# Altium schematic sheet 17.SchDoc
size 513 x 386 mm
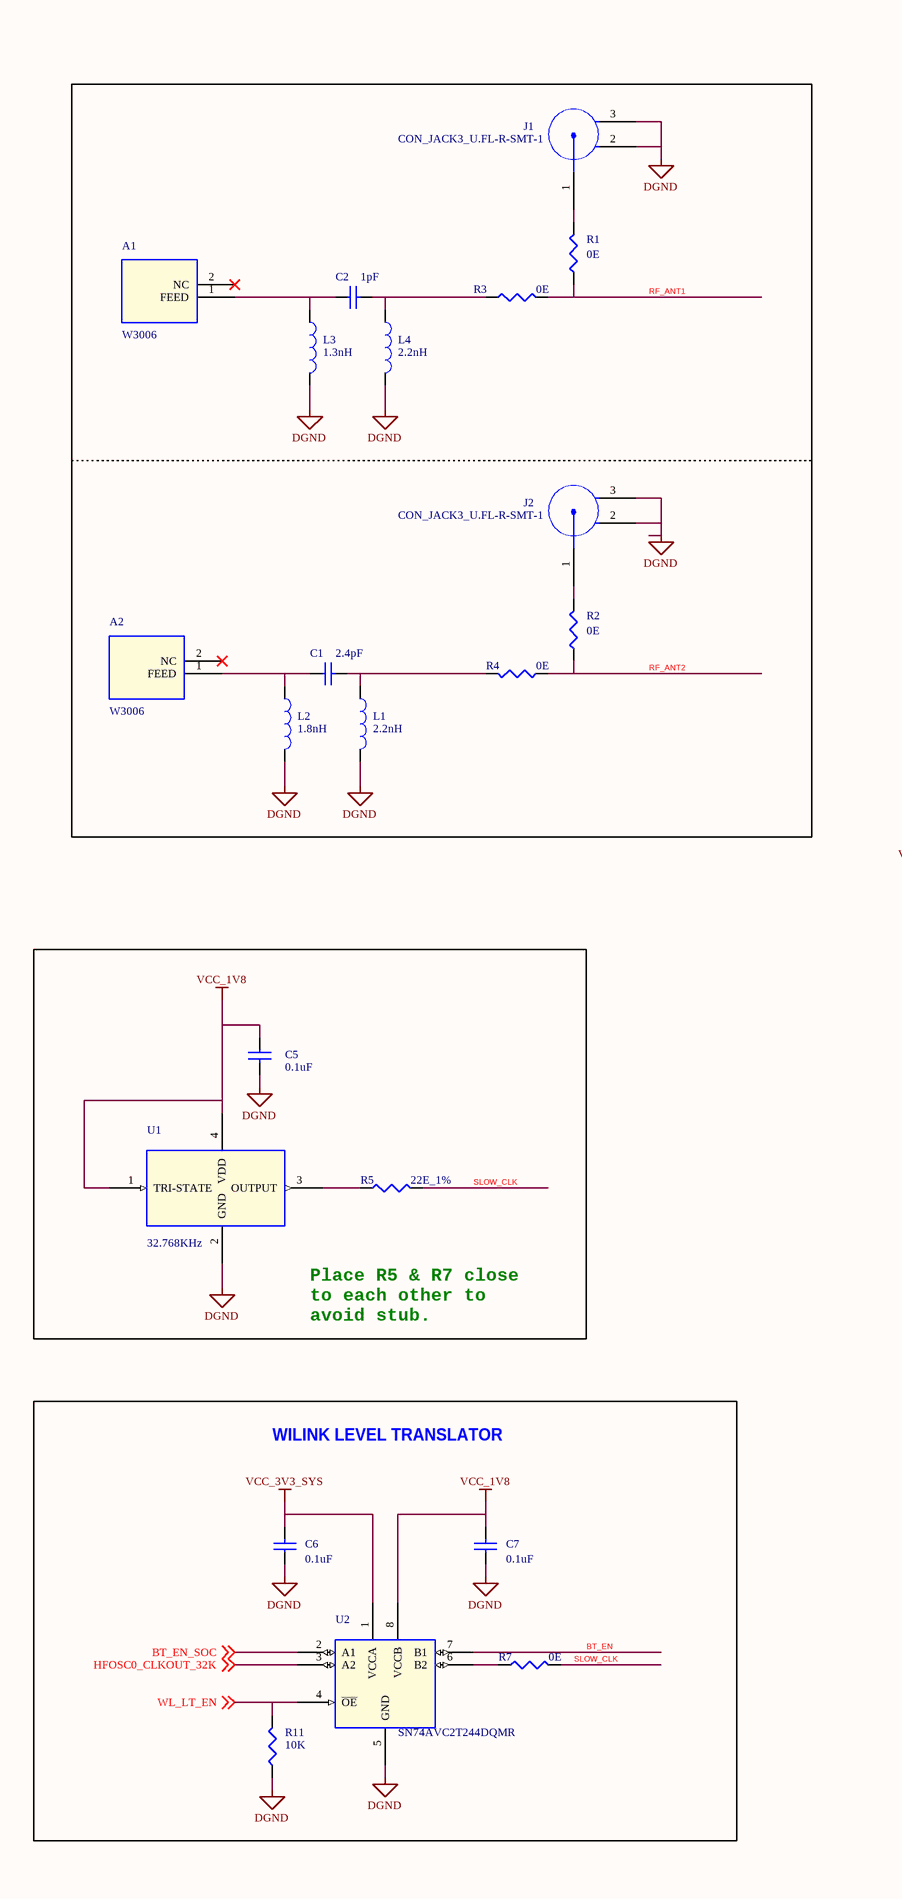
[diagram p0: 17.SchDoc, left]
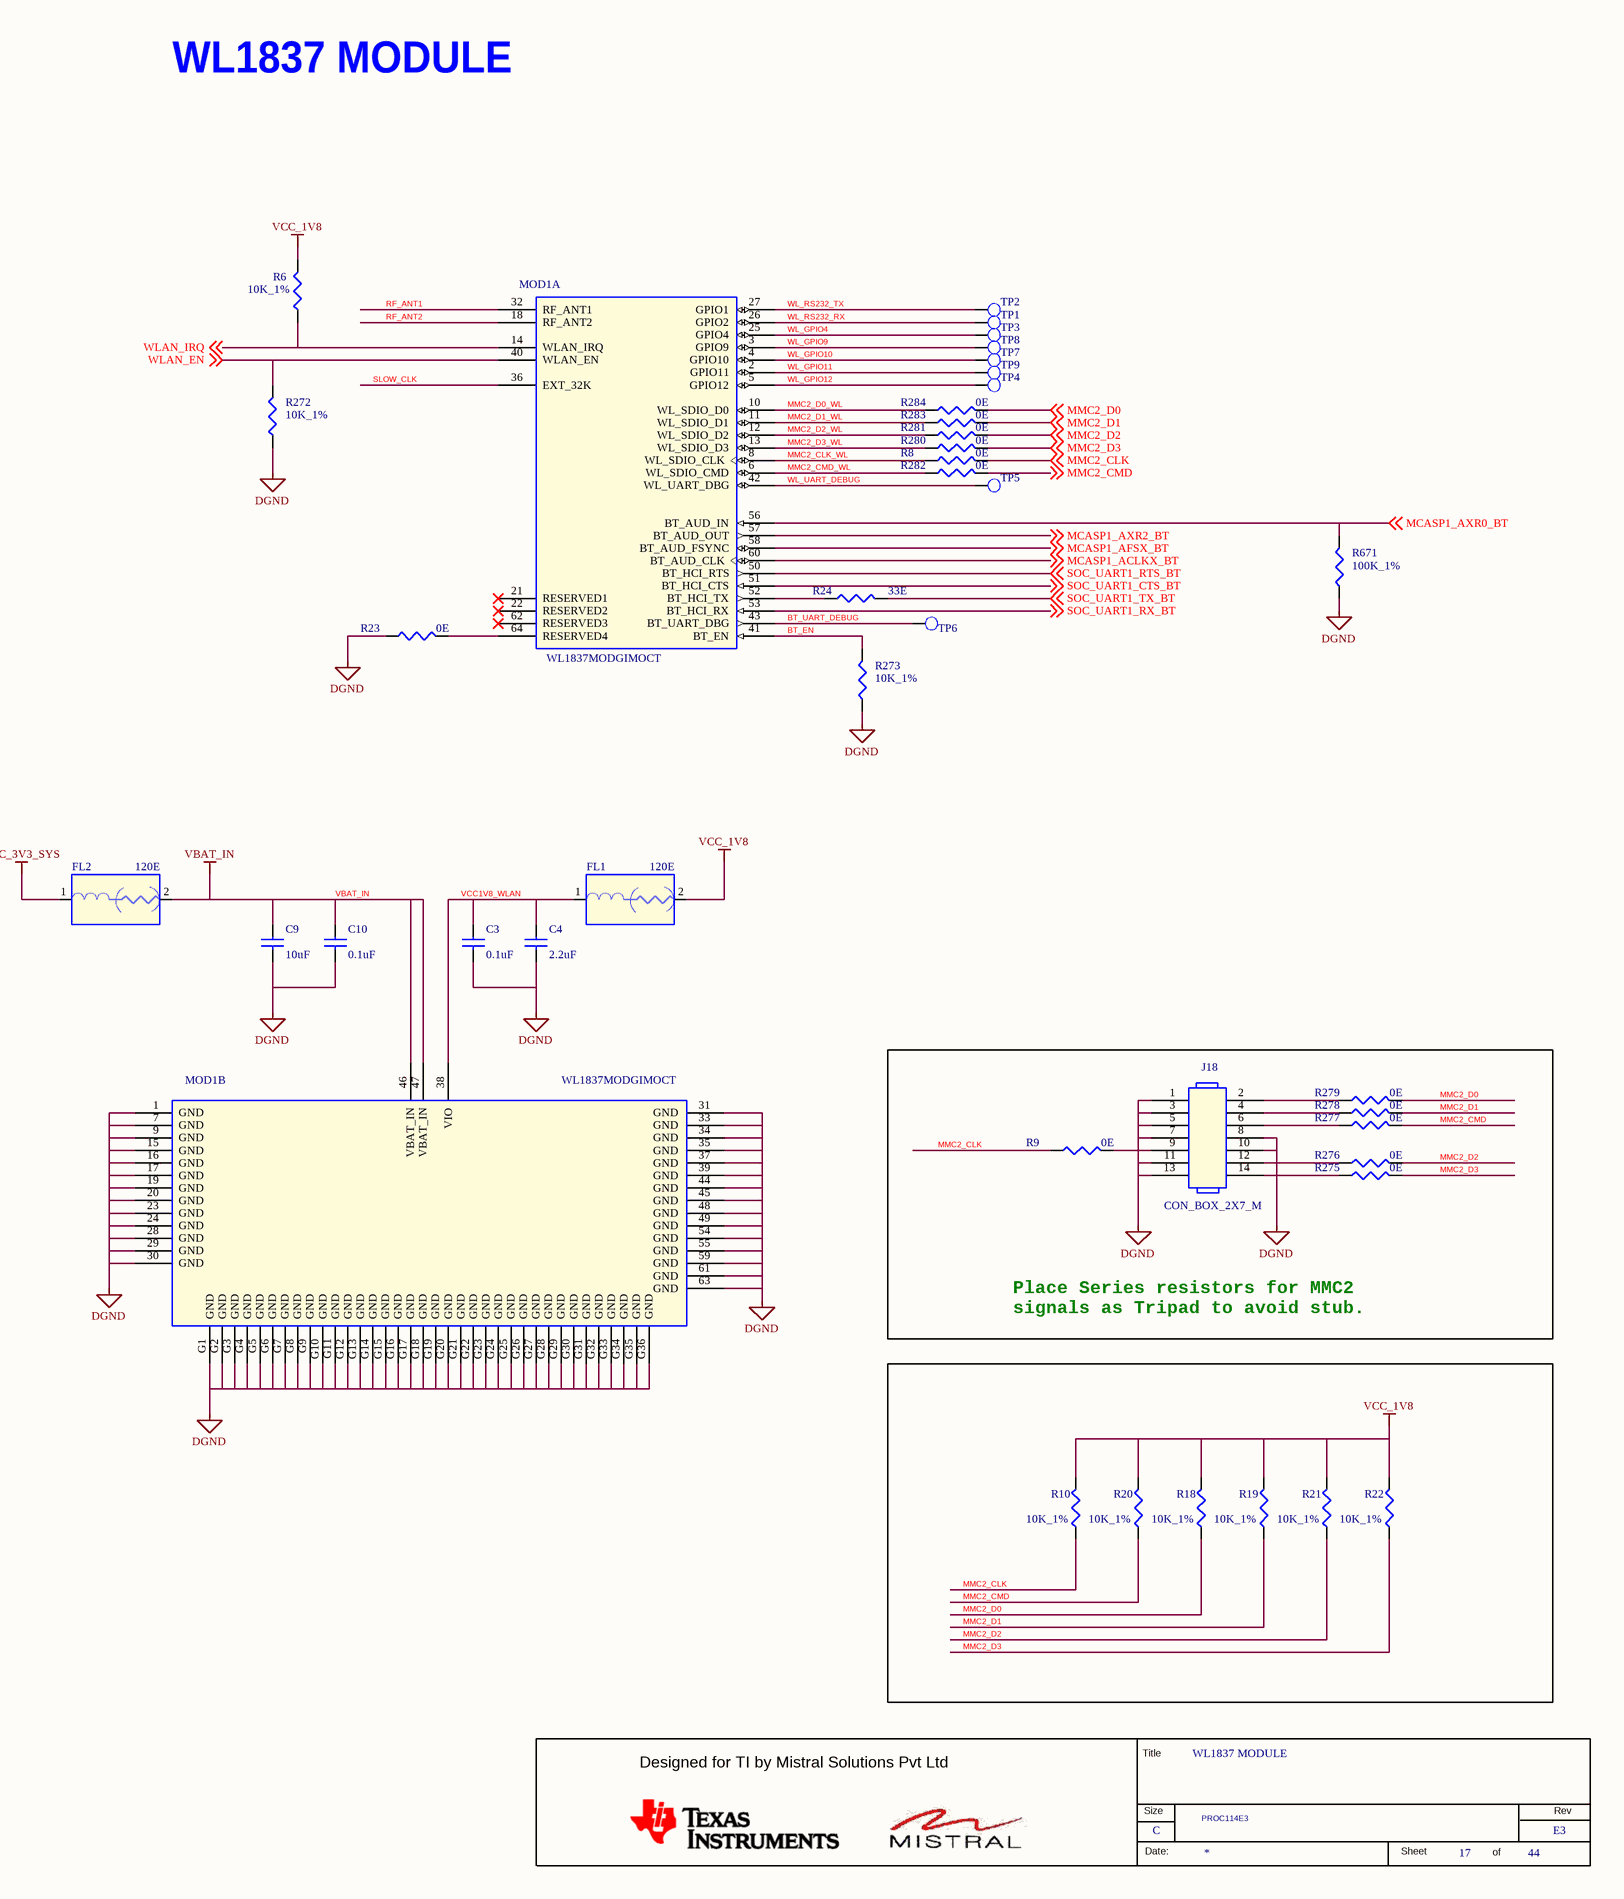
[diagram p1: 17.SchDoc, right]

## Parts
*  RevCode: E3  Title: WL1837 MODULE  Page Size: C  Page Number: 17  Page Count: 44  Variant Name: PROC114E3  (hidden comment: MISTRAL_TITLEBLK_CSIZE)  (graphical)
A1  W3006  [ANT2_W3006_390X130_SMD]
A2  W3006  [ANT2_W3006_390X130_SMD]
C1  2.4pF  [CAP0402_0-75]
C2  1pF  [CAP0402_0-75]
C3  0.1uF  [CAP0201_0-5]
C4  2.2uF  [CAP0402_0-75]
C5  0.1uF  [CAP0201_0-5]
C6  0.1uF  [CAP0201_0-5]
C7  0.1uF  [CAP0201_0-5]
C9  10uF  [CAP0402_0-75]
C10  0.1uF  [CAP0201_0-5]
FL1  120E  [EMIFIL_BLM15A_0402_0-6]
FL2  120E  [EMIFIL_BLM15A_0402_0-6]
J1  CON_JACK3_U.FL-R-SMT-1  [CON_JACK3_U-FL-R-SMT_P_S_S_1-3]
J2  CON_JACK3_U.FL-R-SMT-1  [CON_JACK3_U-FL-R-SMT_P_S_S_1-3]
J18  CON_BOX_2X7_M  [CON_BOX2X7_3020-14-0300-00_P_S_S_10-4]
L1  2.2nH  [IND0402_0-6]
L2  1.8nH  [IND0402_0-6]
L3  1.3nH  [IND0402_0-6]
L4  2.2nH  [IND0402_0-6]
MOD1  WL1837MODGIMOCT  [MOD100_WL1831M_530X530]  (parts A,B of 2)
R1  0E  [RES0402_0-5]
R2  0E  [RES0402_0-5]
R3  0E  [RES0402_0-5]
R4  0E  [RES0402_0-5]
R5  22E_1%  [RES0201_0-5]
R6  10K_1%  [RES0201_0-5]
R7  0E  [RES0201_0-5]
R8  0E  [RES0402_0-5]
R9  0E  [RES0402_0-5]
R10  10K_1%  [RES0201_0-5]
R11  10K  [RES0201_0-5]
R18  10K_1%  [RES0201_0-5]
R19  10K_1%  [RES0201_0-5]
R20  10K_1%  [RES0201_0-5]
R21  10K_1%  [RES0201_0-5]
R22  10K_1%  [RES0201_0-5]
R23  0E  [RES0402_0-5]
R24  33E  [RES0201_0-5]
R272  10K_1%  [RES0201_0-5]
R273  10K_1%  [RES0201_0-5]
R275  0E  [RES0402_0-5]
R276  0E  [RES0402_0-5]
R277  0E  [RES0402_0-5]
R278  0E  [RES0402_0-5]
R279  0E  [RES0402_0-5]
R280  0E  [RES0402_0-5]
R281  0E  [RES0402_0-5]
R282  0E  [RES0402_0-5]
R283  0E  [RES0402_0-5]
R284  0E  [RES0402_0-5]
R671  100K_1%  [RES0402_0-5]
TP1  TP20_SMD  [TP20_SMD]  (value not drawn)
TP2  TP20_SMD  [TP20_SMD]  (value not drawn)
TP3  TP20_SMD  [TP20_SMD]  (value not drawn)
TP4  TP20_SMD  [TP20_SMD]  (value not drawn)
TP5  TP20_SMD  [TP20_SMD]  (value not drawn)
TP6  TP20_SMD  [TP20_SMD]  (value not drawn)
TP7  TP20_SMD  [TP20_SMD]  (value not drawn)
TP8  TP20_SMD  [TP20_SMD]  (value not drawn)
TP9  TP20_SMD  [TP20_SMD]  (value not drawn)
U1  32.768KHz  [OSC4_ASDK_105X85_SMD]
U2  SN74AVC2T244DQMR  [X2SON8_15-74_70X50]

## Blocks framed on the sheet
WILINK LEVEL TRANSLATOR: C6 C7 R7 R11 U2

## Nets
DGND: C3.2 C4.2 C5.2 C6.1 C7.1 C9.2 C10.2 J1.2(GND1) J1.3(GND2) J2.2(GND1) J2.3(GND2) J18.1 J18.3 J18.5 J18.7 J18.8 J18.10 J18.11 J18.13 L1.2 L2.2 L3.2 L4.2 MOD1.1(GND) MOD1.7(GND) MOD1.9(GND) MOD1.15(GND) MOD1.16(GND) MOD1.17(GND) MOD1.19(GND) MOD1.20(GND) MOD1.23(GND) MOD1.24(GND) MOD1.28(GND) MOD1.29(GND) MOD1.30(GND) MOD1.31(GND) MOD1.33(GND) MOD1.34(GND) MOD1.35(GND) MOD1.37(GND) MOD1.39(GND) MOD1.44(GND) MOD1.45(GND) MOD1.48(GND) MOD1.49(GND) MOD1.54(GND) MOD1.55(GND) MOD1.59(GND) MOD1.61(GND) MOD1.63(GND) MOD1.G1(GND) MOD1.G2(GND) MOD1.G3(GND) MOD1.G4(GND) MOD1.G5(GND) MOD1.G6(GND) MOD1.G7(GND) MOD1.G8(GND) MOD1.G9(GND) MOD1.G10(GND) MOD1.G11(GND) MOD1.G12(GND) MOD1.G13(GND) MOD1.G14(GND) MOD1.G15(GND) MOD1.G16(GND) MOD1.G17(GND) MOD1.G18(GND) MOD1.G19(GND) MOD1.G20(GND) MOD1.G21(GND) MOD1.G22(GND) MOD1.G23(GND) MOD1.G24(GND) MOD1.G25(GND) MOD1.G26(GND) MOD1.G27(GND) MOD1.G28(GND) MOD1.G29(GND) MOD1.G30(GND) MOD1.G31(GND) MOD1.G32(GND) MOD1.G33(GND) MOD1.G34(GND) MOD1.G35(GND) MOD1.G36(GND) R11.1 R23.1 R272.2 R273.1 R671.1 U1.2(GND) U2.5(GND)
VBAT_IN: C9.1 C10.1 FL2.2 MOD1.46(VBAT_IN) MOD1.47(VBAT_IN)
VCC_1V8: C5.1 C7.2 FL1.2 R6.2 R10.2 R18.2 R19.2 R20.2 R21.2 R22.2 U1.1(TRI-STATE) U1.4(VDD) U2.8(VCCB)
VCC_3V3_SYS: C6.2 FL2.1 U2.1(VCCA)
BT_EN: MOD1.41(BT_EN) R273.2 U2.7(B1)
BT_EN_SOC: U2.2(A1) ; off-sheet BT_EN_SOC
BT_UART_DEBUG: MOD1.43(BT_UART_DBG) TP6.1(TP)
HFOSC0_CLKOUT_32K: U2.3(A2) ; off-sheet HFOSC0_CLKOUT_32K
MCASP1_ACLKX_BT: MOD1.60(BT_AUD_CLK) ; off-sheet MCASP1_ACLKX_BT
MCASP1_AFSX_BT: MOD1.58(BT_AUD_FSYNC) ; off-sheet MCASP1_AFSX_BT
MCASP1_AXR0_BT: MOD1.56(BT_AUD_IN) R671.2 ; off-sheet MCASP1_AXR0_BT
MCASP1_AXR2_BT: MOD1.57(BT_AUD_OUT) ; off-sheet MCASP1_AXR2_BT
MMC2_CLK: R8.2 R9.1 R10.1 ; off-sheet MMC2_CLK
MMC2_CLK_WL: MOD1.8(WL_SDIO_CLK) R8.1
MMC2_CMD: R20.1 R277.2 R282.2 ; off-sheet MMC2_CMD
MMC2_CMD_WL: MOD1.6(WL_SDIO_CMD) R282.1
MMC2_D0: R18.1 R279.2 R284.2 ; off-sheet MMC2_D0
MMC2_D0_WL: MOD1.10(WL_SDIO_D0) R284.1
MMC2_D1: R19.1 R278.2 R283.2 ; off-sheet MMC2_D1
MMC2_D1_WL: MOD1.11(WL_SDIO_D1) R283.1
MMC2_D2: R21.1 R276.2 R281.2 ; off-sheet MMC2_D2
MMC2_D2_WL: MOD1.12(WL_SDIO_D2) R281.1
MMC2_D3: R22.1 R275.2 R280.2 ; off-sheet MMC2_D3
MMC2_D3_WL: MOD1.13(WL_SDIO_D3) R280.1
RF_ANT1: MOD1.32(RF_ANT1) R1.1 R3.2
RF_ANT2: MOD1.18(RF_ANT2) R2.1 R4.1
SLOW_CLK: MOD1.36(EXT_32K) R5.2 R7.2
SOC_UART1_CTS_BT: MOD1.51(BT_HCI_CTS) ; off-sheet SOC_UART1_CTS_BT
SOC_UART1_RTS_BT: MOD1.50(BT_HCI_RTS) ; off-sheet SOC_UART1_RTS_BT
SOC_UART1_RX_BT: MOD1.53(BT_HCI_RX) ; off-sheet SOC_UART1_RX_BT
SOC_UART1_TX_BT: R24.2 ; off-sheet SOC_UART1_TX_BT
VCC1V8_WLAN: C3.1 C4.1 FL1.1 MOD1.38(VIO)
WL_GPIO4: MOD1.25(GPIO4) TP3.1(TP)
WL_GPIO9: MOD1.3(GPIO9) TP8.1(TP)
WL_GPIO10: MOD1.4(GPIO10) TP7.1(TP)
WL_GPIO11: MOD1.2(GPIO11) TP9.1(TP)
WL_GPIO12: MOD1.5(GPIO12) TP4.1(TP)
WL_LT_EN: R11.2 U2.4(~{OE}) ; off-sheet WL_LT_EN
WL_RS232_RX: MOD1.26(GPIO2) TP1.1(TP)
WL_RS232_TX: MOD1.27(GPIO1) TP2.1(TP)
WL_UART_DEBUG: MOD1.42(WL_UART_DBG) TP5.1(TP)
WLAN_EN: MOD1.40(WLAN_EN) R272.1 ; off-sheet WLAN_EN
WLAN_IRQ: MOD1.14(WLAN_IRQ) R6.1 ; off-sheet WLAN_IRQ
NetA1_1: A1.1(FEED) C2.1 L3.1
NetA2_1: A2.1(FEED) C1.1 L2.1
NetC1_2: C1.2 L1.1 R4.2
NetC2_2: C2.2 L4.1 R3.1
NetJ1_1: J1.1(FEED) R1.2
NetJ2_1: J2.1(FEED) R2.2
NetJ18_2: J18.2 R279.1
NetJ18_4: J18.4 R278.1
NetJ18_6: J18.6 R277.1
NetJ18_9: J18.9 R9.2
NetJ18_12: J18.12 R276.1
NetJ18_14: J18.14 R275.1
NetMOD1_52: MOD1.52(BT_HCI_TX) R24.1
NetMOD1_64: MOD1.64(RESERVED4) R23.2
NetR5_1: R5.1 U1.3(OUTPUT)
NetR7_1: R7.1 U2.6(B2)

Not connected (* = marked no-connect by the designer): A1 2(NC)*; A2 2(NC)*; MOD1 21(RESERVED1)* 22(RESERVED2)* 62(RESERVED3)*

## Notes on the sheet
- WL1837 MODULE
- (near U1) Place R5 & R7 close
  to each other to
  avoid stub.
- Place Series resistors for MMC2
  signals as Tripad to avoid stub.
- (in symbol MISTRAL_TITLEBLK_CSIZE) Title; Designed for TI by Mistral Solutions Pvt Ltd; Size; Rev; Date:; Sheet; of

## Library data of the parts
* = MISTRAL_TITLEBLK_CSIZE: Issue: 1.0; Page Create Date: March  8, 1995; Page Modify Date: *; Schematic Page Count: 44; Schematic Page Number: 17
A1 A2 = ANT_431115300245: ANTENNA  DUALBAND W-LAN CERAMIC CHIP SMD; Mfr_name: PULSE; Mistral Part No: 130015010025-R; Wattage: NA; Project: DCMIST_WLAN; Chkd/date: NAVEED/280115; Crtd /date: VASANTHA/080115; Datasheet: Y:\MIS_DATABASE\DATASHEETS\ANTENNAS\W3006.PDF; Temperature: -40°C+85°C; Weight: 240mg; Height: 1.50MM; Library Ref: ANT_431115300245; Distributor_part_number: 673-W3006; Distributor_name: MOUSER; Package: SMD; Voltage: NA; Tolerance: NA; Part_type: ANTENNA; Mfr_part_number: W3006; PCB Footprint: ANT2_W3006_390X130_SMD
C1 = CAP_Dup2: CAP CERAMIC 2.4pF 50V 0.1pF HI-Q C0G(NP0) 0402; Part_type: CAPACITORS\CERAMIC; Mfr_part_number: GJM1555C1H2R4BB01D; Mfr_name: MURATA; Mistral Part No: 120016050011-R; Custom_Duty: 15%; Customs_HS_Code: 85322990; Wattage: NA; Tolerance: 0.1pF%; Project: TMDXCSK368; Footprint Path: Y:\MIS_DATABASE\Library\ALTIUM_TOOL\PCB_FOOTPRINTS\Altium_Footprint_Lib.PcbLib; Library Path: Y:\MIS_DATABASE\Library\ALTIUM_TOOL\SCHEMATICS_PARTS\MS_DISCRETE_Library.schlib; MECHANICAL 3D STEP FILE: CAP0402_0-75; Chkd/date: VASANTHA/300516; Crtd /date: VASANTHA/300516; Datasheet: Y:\MIS_DATABASE\DATASHEETS\CAPACITORS\MURATA-GXX-SER_NOV17.PDF; Temperature: -55°C+125°C; Weight: 6mg; Height: 0.55MM; Library Ref: CAP; Distributor_part_number: 490-8093-1-ND; Distributor_name: DIGIKEY; Package: 0402; Voltage: 50V; Footprint Ref: CAP0402_0-75; PCB Footprint: CAP0402_0-75
C2 = CAP_Dup2: CAP CERAMIC 1pF 50V 0.1pF HI-Q C0G(NP0) 0402; Mistral Part No: 120016050010-R; Mfr_name: MURATA; Mfr_part_number: GJM1555C1H1R0BB01D; Part_type: CAPACITORS\CERAMIC; Project: TMDXCSK368; Tolerance: 0.1pF%; Wattage: NA; Customs_HS_Code: 85322990; Custom_Duty: 15%; Footprint Ref: CAP0402_0-75; Voltage: 50V; Package: 0402; Distributor_name: DIGIKEY; Distributor_part_number: 490-6073-1-ND; Library Ref: CAP; Height: 0.55MM; Weight: 6mg; Temperature: -55°C+125°C; Datasheet: Y:\MIS_DATABASE\DATASHEETS\CAPACITORS\MURATA-GXX-SER_NOV17.PDF; Crtd /date: VASANTHA/300516; Chkd/date: VASANTHA/300516; MECHANICAL 3D STEP FILE: CAP0402_0-75; Library Path: Y:\MIS_DATABASE\Library\ALTIUM_TOOL\SCHEMATICS_PARTS\MS_DISCRETE_Library.schlib; Footprint Path: Y:\MIS_DATABASE\Library\ALTIUM_TOOL\PCB_FOOTPRINTS\Altium_Footprint_Lib.PcbLib; PCB Footprint: CAP0402_0-75
C3 C10 = CAP_Dup2: CAP CERAMIC 0.1uF 16V 10% X5R 0201; Alt_Mfr_name: YAGEO AMERICA; Part_type: CAPACITORS\CERAMIC; Mfr_part_number: GRM033R61C104KE14D; Mfr_name: MURATA; Mistral Part No: 120009030072-R; Alt_Mfr_part_number: CC0402KRX5R8BB104; Custom_Duty: 15%; Customs_HS_Code: 85322990; Wattage: NA; Project: TI_MAXIE_CPB; PCB Footprint: CAP0201_0-5; Footprint Path: Y:\MIS_DATABASE\Library\ALTIUM_TOOL\PCB_FOOTPRINTS\Altium_Footprint_Lib.PcbLib; Library Path: Y:\MIS_DATABASE\Library\ALTIUM_TOOL\SCHEMATICS_PARTS\MS_DISCRETE_Library.schlib; Footprint Ref: CAP0201_0-5; Library Ref: CAP; MECHANICAL 3D STEP FILE: CAP0201_0-5; Chkd/date: MANIRAJA/230118; Crtd /date: MANIRAJA/230118; Datasheet: Y:\MIS_DATABASE\DATASHEETS\CAPACITORS\GRM033R61C104KE14.PDF; Temperature: -55°C+85°C; Weight: 0.33mg; Height: 0.33MM; Distributor_part_number: 490-14305-1-ND; Distributor_name: DIGIKEY; Package: 0201; Voltage: 16V; Tolerance: 10%
C4 = CAP_Dup2: CAP CERAMIC 2.2uF 25V 10% X5R 0402; Mistral Part No: 120015120001-R; Mfr_name: MURATA; Mfr_part_number: GRM155R61E225KE11D; Part_type: CAPACITORS\CERAMIC; Project: TI_AM263X_CC; Wattage: NA; Customs_HS_Code: 85322990; Custom_Duty: 15%; PCB Footprint: CAP0402_0-75; Library Ref: CAP; Tolerance: 10%; Voltage: 25V; Package: 0402; Distributor_name: DIGIKEY; Distributor_part_number: 490-12703-1-ND; Height: 0.70MM; Weight: 1.5mg; Temperature: -55°C+85°C; Datasheet: Y:\MIS_DATABASE\DATASHEETS\CAPACITORS\GRM155R61E225KE11.PDF; Crtd /date: MANIRAJA/010721; Chkd/date: ALVY/010721; MECHANICAL 3D STEP FILE: CAP0402_0-75; Footprint Ref: CAP0402_0-75; Library Path: Y:\MIS_DATABASE\Library\ALTIUM_TOOL\SCHEMATICS_PARTS\MS_DISCRETE_Library.schlib; Footprint Path: Y:\MIS_DATABASE\Library\ALTIUM_TOOL\PCB_FOOTPRINTS\Altium_Footprint_Lib.PcbLib
C5-C7 = CAP_Dup2: CAP CERAMIC 0.1uF 16V 10% X5R 0201; Alt_Mfr_part_number: CC0402KRX5R8BB104; Mistral Part No: 120009030072-R; Mfr_name: MURATA; Mfr_part_number: GRM033R61C104KE14D; Part_type: CAPACITORS\CERAMIC; Alt_Mfr_name: YAGEO AMERICA; Project: TI_MAXIE_CPB; Wattage: NA; Customs_HS_Code: 85322990; Custom_Duty: 15%; PCB Footprint: CAP0201_0-5; Tolerance: 10%; Voltage: 16V; Package: 0201; Distributor_name: DIGIKEY; Distributor_part_number: 490-14305-1-ND; Height: 0.33MM; Weight: 0.33mg; Temperature: -55°C+85°C; Datasheet: Y:\MIS_DATABASE\DATASHEETS\CAPACITORS\GRM033R61C104KE14.PDF; Crtd /date: MANIRAJA/230118; Chkd/date: MANIRAJA/230118; MECHANICAL 3D STEP FILE: CAP0201_0-5; Library Ref: CAP; Footprint Ref: CAP0201_0-5; Library Path: Y:\MIS_DATABASE\Library\ALTIUM_TOOL\SCHEMATICS_PARTS\MS_DISCRETE_Library.schlib; Footprint Path: Y:\MIS_DATABASE\Library\ALTIUM_TOOL\PCB_FOOTPRINTS\Altium_Footprint_Lib.PcbLib
C9 = CAP_Dup2: CAP CERAMIC 10uF 10V 20% X5R 0402; Part_type: CAPACITORS\CERAMIC; Mfr_part_number: GRM155R61A106ME11D; Mfr_name: MURATA; Mistral Part No: 120013110019-R; Wattage: NA; Custom_Duty: 15%; Customs_HS_Code: 85322990; Project: QCS610_NANOSOM; PCB Footprint: CAP0402_0-75; Footprint Path: Y:\MIS_DATABASE\Library\ALTIUM_TOOL\PCB_FOOTPRINTS\Altium_Footprint_Lib.PcbLib; Library Path: Y:\MIS_DATABASE\Library\ALTIUM_TOOL\SCHEMATICS_PARTS\MS_DISCRETE_Library.schlib; Footprint Ref: CAP0402_0-75; MECHANICAL 3D STEP FILE: CAP0402_0-75; Temperature: -55°C+85°C; Weight: 3.1mg; Chkd/date: MANIRAJA/300520; Crtd /date: ALVY/260520; Datasheet: Y:\MIS_DATABASE\DATASHEETS\CAPACITORS\MURATA-GXX-SER_NOV17.PDF; Height: 0.55MM; Distributor_part_number: 490-GRM155R61A106ME11DTR-ND; Distributor_name: DIGIKEY; Package: 0402; Voltage: 10V; Tolerance: 20%; Library Ref: CAP
FL1 = EMIFILTER_IND: IND FERRITE BEAD CHIP 120E 2A 0402; Part_type: INDUCTOR; Mfr_part_number: BLM15PX121SN1D; Mfr_name: MURATA; Mistral Part No: 130013060022-R; Custom_Duty: 24%; Customs_HS_Code: 85369090; Wattage: NA; Tolerance: 25%; Project: GEN_3-8; PCB Footprint: EMIFIL_BLM15A_0402_0-6; Footprint Path: Y:\MIS_DATABASE\Library\ALTIUM_TOOL\PCB_FOOTPRINTS\Altium_Footprint_Lib.PcbLib; Library Path: Y:\MIS_DATABASE\Library\ALTIUM_TOOL\SCHEMATICS_PARTS\MS_FILTER_Library.schlib; MECHANICAL 3D STEP FILE: EMIFIL_BLM15A_0402_0-6; Footprint Ref: EMIFIL_BLM15A_0402_0-6; Chkd/date: NAVEED/241114; Crtd /date: USMAN/170613; Datasheet: Y:\MIS_DATABASE\DATASHEETS\DISCRETES\INDUCTORS\BLM15-SN1-SER.PDF; Temperature: -55°C+125°C; Weight: 1mg; Height: 0.55MM; Library Ref: EMIFILTER_IND; Distributor_part_number: 490-9656-1-ND; Distributor_name: DIGIKEY; Package: 0402; Voltage: NA
FL2 = EMIFILTER_IND: IND FERRITE BEAD CHIP 120E 2A 0402; Mistral Part No: 130013060022-R; Mfr_name: MURATA; Mfr_part_number: BLM15PX121SN1D; Part_type: INDUCTOR; Project: GEN_3-8; Tolerance: 25%; Voltage: NA; Customs_HS_Code: 85369090; Custom_Duty: 24%; PCB Footprint: EMIFIL_BLM15A_0402_0-6; Footprint Path: Y:\MIS_DATABASE\Library\ALTIUM_TOOL\PCB_FOOTPRINTS\Altium_Footprint_Lib.PcbLib; Library Path: Y:\MIS_DATABASE\Library\ALTIUM_TOOL\SCHEMATICS_PARTS\MS_FILTER_Library.schlib; MECHANICAL 3D STEP FILE: EMIFIL_BLM15A_0402_0-6; Footprint Ref: EMIFIL_BLM15A_0402_0-6; Wattage: NA; Package: 0402; Distributor_name: DIGIKEY; Distributor_part_number: 490-9656-1-ND; Library Ref: EMIFILTER_IND; Height: 0.55MM; Weight: 1mg; Temperature: -55°C+125°C; Datasheet: Y:\MIS_DATABASE\DATASHEETS\DISCRETES\INDUCTORS\BLM15-SN1-SER.PDF; Crtd /date: USMAN/170613; Chkd/date: NAVEED/241114
J1 = CON_3_U.FL-R-SMT: CON JACK 3POS MALE ST SMD; Part_type: CONNECTOR\JACK; Mfr_part_number: U.FL-R-SMT-1(01); Mfr_name: HIROSE ELECTRIC EUROPE; Mistral Part No: 150009030465-R; Custom_Duty: 24%; Customs_HS_Code: 85369090; Wattage: NA; Project: AXON; PCB Footprint: CON_JACK3_U-FL-R-SMT_P_S_S_1-3; Footprint Path: Y:\MIS_DATABASE\Library\ALTIUM_TOOL\PCB_FOOTPRINTS\Altium_Footprint_Lib.PcbLib; Library Path: Y:\MIS_DATABASE\Library\ALTIUM_TOOL\SCHEMATICS_PARTS\MS_CONNECTOR_Library.schlib; MECHANICAL 3D STEP FILE: CON_JACK3_U-FL-R-SMT_P_S_S_1-3; Chkd/date: NAVEED/301214; Crtd /date: USMAN/230309; Datasheet: Y:\MIS_DATABASE\DATASHEETS\CONNECTORS\U.FL-R-SMT.PDF; Temperature: -40°C+90°C; Weight: 15.7mg; Height: 1.25MM; Library Ref: CON_3_U.FL-R-SMT; Distributor_part_number: H122041-ND; Distributor_name: DIGIKEY; Package: SMD; Voltage: NA; Tolerance: NA; Footprint Ref: CON_JACK3_U-FL-R-SMT_P_S_S_1-3
J2 = CON_3_U.FL-R-SMT: CON JACK 3POS MALE ST SMD; Mistral Part No: 150009030465-R; Mfr_name: HIROSE ELECTRIC EUROPE; Mfr_part_number: U.FL-R-SMT-1(01); Part_type: CONNECTOR\JACK; Project: AXON; Tolerance: NA; Customs_HS_Code: 85369090; Custom_Duty: 24%; Footprint Ref: CON_JACK3_U-FL-R-SMT_P_S_S_1-3; Voltage: NA; Wattage: NA; Package: SMD; Distributor_name: DIGIKEY; Distributor_part_number: H122041-ND; Library Ref: CON_3_U.FL-R-SMT; Height: 1.25MM; Weight: 15.7mg; Temperature: -40°C+90°C; Datasheet: Y:\MIS_DATABASE\DATASHEETS\CONNECTORS\U.FL-R-SMT.PDF; Crtd /date: USMAN/230309; Chkd/date: NAVEED/301214; MECHANICAL 3D STEP FILE: CON_JACK3_U-FL-R-SMT_P_S_S_1-3; Library Path: Y:\MIS_DATABASE\Library\ALTIUM_TOOL\SCHEMATICS_PARTS\MS_CONNECTOR_Library.schlib; Footprint Path: Y:\MIS_DATABASE\Library\ALTIUM_TOOL\PCB_FOOTPRINTS\Altium_Footprint_Lib.PcbLib; PCB Footprint: CON_JACK3_U-FL-R-SMT_P_S_S_1-3
J18 = HEADER_7X2: CON BOX 2X7 2.54MM PITCH MALE ST SMD; Mistral Part No: 150021090012-R; Mfr_name: CnC TECH; Mfr_part_number: 3020-14-0300-00; Part_type: CONNECTOR\BOX HEADERS; Project: TI_AM335x SK_BRD; Tolerance: NA; Customs_HS_Code: 85369090; Custom_Duty: 24%; PCB Footprint: CON_BOX2X7_3020-14-0300-00_P_S_S_10-4; Footprint Path: Y:\MIS_DATABASE\Library\ALTIUM_TOOL\PCB_FOOTPRINTS\Altium_Footprint_Lib.PcbLib; Library Path: Y:\MIS_DATABASE\Library\ALTIUM_TOOL\SCHEMATICS_PARTS\MS_CONNECTOR_Library.schlib; MECHANICAL 3D STEP FILE: CON_BOX2X7_3020-14-0300-00_P_S_S_10-4; Footprint Ref: CON_BOX2X7_3020-14-0300-00_P_S_S_10-4; Voltage: NA; Wattage: NA; Package: SMD; Distributor_name: DIGIKEY; Distributor_part_number: 1175-1622-ND; Library Ref: HEADER_7X2; Height: 10.32MM; Weight: NA; Temperature: -40°C+105°C; Datasheet: Y:\MIS_DATABASE\DATASHEETS\CONNECTORS\3020-XX-0300-00.PDF; Crtd /date: ALVY/080921; Chkd/date: MANIRAJA/080921
L1 = INDUCTOR_Dup1: IND CHIP 2.2nH 900mA 0.1nH% 0402; Mfr_part_number: LQG15HS2N2B02D; Mfr_name: MURATA; Mistral Part No: 130021100005-R; Custom_Duty: 24%; Customs_HS_Code: 85437099; Wattage: NA; Project: TI_AM62x SKEVM_BRD; Chkd/date: MANIRAJA/061021; Crtd /date: ALVY/051021; Datasheet: Y:\MIS_DATABASE\DATASHEETS\DISCRETES\INDUCTORS\LQG15HS-SER.PDF; Temperature: -55°C+125°C; Weight: 1mg; Height: 0.55MM; Library Ref: INDUCTOR; Distributor_part_number: 490-LQG15HS2N2B02DCT-ND; Distributor_name: DIGIKEY; Package: 0402; Voltage: NA; Tolerance: 0.1nH%; Part_type: INDUCTOR; Footprint Ref: IND0402_0-6; MECHANICAL 3D STEP FILE: IND0402_0-6; Library Path: Y:\MIS_DATABASE\Library\ALTIUM_TOOL\SCHEMATICS_PARTS\MS_DISCRETE_Library.schlib; Footprint Path: Y:\MIS_DATABASE\Library\ALTIUM_TOOL\PCB_FOOTPRINTS\Altium_Footprint_Lib.PcbLib; PCB Footprint: IND0402_0-6
L2 = INDUCTOR_Dup1: IND CHIP 1.8nH 950mA 0.1nH% 0402; Mfr_part_number: LQG15HS1N8B02D; Mfr_name: MURATA; Mistral Part No: 130021100006-R; Custom_Duty: 24%; Customs_HS_Code: 85437099; Wattage: NA; Project: TI_AM62x SKEVM_BRD; Chkd/date: MANIRAJA/061021; Crtd /date: ALVY/051021; Datasheet: Y:\MIS_DATABASE\DATASHEETS\DISCRETES\INDUCTORS\LQG15HS-SER.PDF; Temperature: -55°C+125°C; Weight: 1mg; Height: 0.55MM; Library Ref: INDUCTOR; Distributor_part_number: 490-LQG15HS1N8B02DTR-ND; Distributor_name: DIGIKEY; Package: 0402; Voltage: NA; Tolerance: 0.1nH%; Part_type: INDUCTOR; Footprint Ref: IND0402_0-6; MECHANICAL 3D STEP FILE: IND0402_0-6; Library Path: Y:\MIS_DATABASE\Library\ALTIUM_TOOL\SCHEMATICS_PARTS\MS_DISCRETE_Library.schlib; Footprint Path: Y:\MIS_DATABASE\Library\ALTIUM_TOOL\PCB_FOOTPRINTS\Altium_Footprint_Lib.PcbLib; PCB Footprint: IND0402_0-6
L3 = INDUCTOR_Dup1: IND CHIP 1.3nH 1A 0.1nH% 0402; Mistral Part No: 130021080043-R; Mfr_name: MURATA; Mfr_part_number: LQG15HS1N3B02D; Project: TI_AM335x SK_BRD; Voltage: NA; Customs_HS_Code: 85437099; Custom_Duty: 24%; Part_type: INDUCTOR; Tolerance: 0.1nH%; Wattage: NA; Package: 0402; Distributor_name: DIGIKEY; Distributor_part_number: 490-LQG15HS1N3B02DTR-ND; Library Ref: INDUCTOR; Height: 0.55MM; Weight: 1mg; Temperature: -55°C+125°C; Datasheet: Y:\MIS_DATABASE\DATASHEETS\DISCRETES\INDUCTORS\LQG15HS-SER.PDF; Crtd /date: MANIRAJA/260821; Chkd/date: ALVY/260821; Footprint Ref: IND0402_0-6; MECHANICAL 3D STEP FILE: IND0402_0-6; Library Path: Y:\MIS_DATABASE\Library\ALTIUM_TOOL\SCHEMATICS_PARTS\MS_DISCRETE_Library.schlib; Footprint Path: Y:\MIS_DATABASE\Library\ALTIUM_TOOL\PCB_FOOTPRINTS\Altium_Footprint_Lib.PcbLib; PCB Footprint: IND0402_0-6
L4 = INDUCTOR_Dup1: IND CHIP 2.2nH 1A 0.1nH% 0402; Mistral Part No: 130021080045-R; Mfr_name: MURATA; Mfr_part_number: LQG15WZ2N2B02D; Project: TI_AM335x SK_BRD; Voltage: NA; Customs_HS_Code: 85437099; Custom_Duty: 24%; Footprint Ref: IND0402_0-6; Part_type: INDUCTOR; Tolerance: 0.1nH%; Wattage: NA; Package: 0402; Distributor_name: MOUSER; Distributor_part_number: 81-LQG15WZ2N2B02D; Library Ref: INDUCTOR; Height: 0.60MM; Weight: 1mg; Temperature: -55°C+125°C; Datasheet: Y:\MIS_DATABASE\DATASHEETS\DISCRETES\INDUCTORS\LQG15WZ2N2B02D.PDF; Crtd /date: MANIRAJA/260821; Chkd/date: ALVY/260821; MECHANICAL 3D STEP FILE: IND0402_0-6; Library Path: Y:\MIS_DATABASE\Library\ALTIUM_TOOL\SCHEMATICS_PARTS\MS_DISCRETE_Library.schlib; Footprint Path: Y:\MIS_DATABASE\Library\ALTIUM_TOOL\PCB_FOOTPRINTS\Altium_Footprint_Lib.PcbLib; PCB Footprint: IND0402_0-6
MOD1 = MODULE_WL1837: MODULE WIFI WILINK BLUETOOTH SMD100; Mfr_name: TEXAS INSTRUMENTS; Mistral Part No: 180016050002-R; Wattage: NA; Project: TMDXCSK8127; PCB Footprint: MOD100_WL1831M_530X530; Chkd/date: VASANTHA/130516; Crtd /date: VASANTHA/130516; Datasheet: Y:\MIS_DATABASE\DATASHEETS\MISC\MODULES\WL1837XXX.PDF; Temperature: -40°C+85°C; Weight: NA; Height: 2.00MM; Library Ref: MODULE_WL1837; Distributor_part_number: 296-43667-1-ND; Distributor_name: DIGIKEY; Package: SMD100; Voltage: NA; Tolerance: NA; Part_type: MODULE; Mfr_part_number: WL1837MODGIMOCT
R1 R4 R23 R275 R276 = RESISTOR_Dup6: RES 0E 1/16W JUMPER 0402; Part_type: RESISTORS\FIXED; Mfr_part_number: CRCW04020000Z0ED; Mfr_name: VISHAY; Mistral Part No: 110010080019-R; Custom_Duty: 15%; Customs_HS_Code: 85332119; Voltage: NA; Project: PB_BUGBASE; PCB Footprint: RES0402_0-5; MECHANICAL 3D STEP FILE: RES0402_0-5; Chkd/date: VASANTHA/201216; Crtd /date: MUDDU/190810; Datasheet: Y:\MIS_DATABASE\DATASHEETS\RESISTORS\CRCW0603.PDF; Temperature: -55°C+155°C; Weight: 0.65mg; Height: 0.40MM; Distributor_part_number: 541-0.0JCT-ND; Distributor_name: DIGIKEY; Package: 0402; Wattage: 1/16W; Tolerance: NA; Library Ref: RESISTOR; Footprint Ref: RES0402_0-5; Library Path: Y:\MIS_DATABASE\Library\ALTIUM_TOOL\SCHEMATICS_PARTS\MS_DISCRETE_Library.schlib; Footprint Path: Y:\MIS_DATABASE\Library\ALTIUM_TOOL\PCB_FOOTPRINTS\Altium_Footprint_Lib.PcbLib
R2 R3 R8 R9 R277-R284 = RESISTOR_Dup6: RES 0E 1/16W JUMPER 0402; Mistral Part No: 110010080019-R; Mfr_name: VISHAY; Mfr_part_number: CRCW04020000Z0ED; Part_type: RESISTORS\FIXED; Project: PB_BUGBASE; Tolerance: NA; Customs_HS_Code: 85332119; Custom_Duty: 15%; PCB Footprint: RES0402_0-5; Footprint Path: Y:\MIS_DATABASE\Library\ALTIUM_TOOL\PCB_FOOTPRINTS\Altium_Footprint_Lib.PcbLib; Library Path: Y:\MIS_DATABASE\Library\ALTIUM_TOOL\SCHEMATICS_PARTS\MS_DISCRETE_Library.schlib; Footprint Ref: RES0402_0-5; Library Ref: RESISTOR; Voltage: NA; Wattage: 1/16W; Package: 0402; Distributor_name: DIGIKEY; Distributor_part_number: 541-0.0JCT-ND; Height: 0.40MM; Weight: 0.65mg; Temperature: -55°C+155°C; Datasheet: Y:\MIS_DATABASE\DATASHEETS\RESISTORS\CRCW0603.PDF; Crtd /date: MUDDU/190810; Chkd/date: VASANTHA/201216; MECHANICAL 3D STEP FILE: RES0402_0-5
R5 = RESISTOR_Dup1: RES 22E 1/20W 1% 0201; Part_type: RESISTORS\FIXED; Mfr_part_number: RC0201FR-0722RL; Mfr_name: YAGEO AMERICA; Mistral Part No: 110009030522-R; Custom_Duty: 15%; Customs_HS_Code: 85332119; Voltage: NA; Project: AM654x_SOM; PCB Footprint: RES0201_0-5; Footprint Path: Y:\MIS_DATABASE\Library\ALTIUM_TOOL\PCB_FOOTPRINTS\Altium_Footprint_Lib.PcbLib; Library Path: Y:\MIS_DATABASE\Library\ALTIUM_TOOL\SCHEMATICS_PARTS\MS_DISCRETE_Library.schlib; MECHANICAL 3D STEP FILE: RES0201_0-5; Chkd/date: MANIRAJA/080319; Crtd /date: ALVY/080319; Datasheet: Y:\MIS_DATABASE\DATASHEETS\RESISTORS\RCXXXXL-SER_MAR18.PDF; Temperature: -55°C+125°C; Weight: 0.17mg; Height: 0.26MM; Library Ref: RESISTOR; Distributor_part_number: YAG2518CT-ND; Distributor_name: DIGIKEY; Package: 0201; Wattage: 1/20W; Tolerance: 1%; Footprint Ref: RES0201_0-5
R6 R10 R272 R273 = RESISTOR_Dup6: RES 10K 1/20W 1% 0201; Part_type: RESISTORS\FIXED; Mfr_part_number: RC0201FR-0710KL; Mfr_name: YAGEO AMERICA; Mistral Part No: 110011040018-R; Custom_Duty: 15%; Customs_HS_Code: 85332119; Voltage: NA; Project: GOLDEN-I LITE; PCB Footprint: RES0201_0-5; MECHANICAL 3D STEP FILE: RES0201_0-5; Chkd/date: VASANTHA/270117; Crtd /date: MANIRAJA/270117; Datasheet: Y:\MIS_DATABASE\DATASHEETS\RESISTORS\RCXXXXL-SER_MAR18.PDF; Temperature: -55°C+125°C; Weight: 0.17mg; Height: 0.26MM; Distributor_part_number: 311-10.0KMCT-ND; Distributor_name: DIGIKEY; Package: 0201; Wattage: 1/20W; Tolerance: 1%; Library Ref: RESISTOR; Footprint Ref: RES0201_0-5; Library Path: Y:\MIS_DATABASE\Library\ALTIUM_TOOL\SCHEMATICS_PARTS\MS_DISCRETE_Library.schlib; Footprint Path: Y:\MIS_DATABASE\Library\ALTIUM_TOOL\PCB_FOOTPRINTS\Altium_Footprint_Lib.PcbLib
R7 = RESISTOR_Dup6: RES 0E 1/20W 5% 0201; Part_type: RESISTORS\FIXED; Mfr_part_number: RC0201JR-070RL; Mfr_name: YAGEO AMERICA; Mistral Part No: 110010070067-R; Custom_Duty: 15%; Customs_HS_Code: 85332119; Voltage: NA; Project: PB_BUGBASE; PCB Footprint: RES0201_0-5; Footprint Path: Y:\MIS_DATABASE\Library\ALTIUM_TOOL\PCB_FOOTPRINTS\Altium_Footprint_Lib.PcbLib; Library Path: Y:\MIS_DATABASE\Library\ALTIUM_TOOL\SCHEMATICS_PARTS\MS_DISCRETE_Library.schlib; MECHANICAL 3D STEP FILE: RES0201_0-5; Chkd/date: NAVEED/301214; Crtd /date: MUDDU/120710; Datasheet: Y:\MIS_DATABASE\DATASHEETS\RESISTORS\RCXXXXL-SER_MAR18.PDF; Temperature: -55°C+125°C; Weight: 0.17mg; Height: 0.26MM; Footprint Ref: RES0201_0-5; Library Ref: RESISTOR; Distributor_part_number: 311-0.0NCT-ND; Distributor_name: DIGIKEY; Package: 0201; Wattage: 1/20W; Tolerance: 5%
R11 = RESISTOR_Dup6: RES 10K 1/20W 5% 0201; Part_type: RESISTORS\FIXED; Mfr_part_number: RC0201JR-0710KL; Mfr_name: YAGEO AMERICA; Mistral Part No: 110010070051-R; Custom_Duty: 15%; Customs_HS_Code: 85332119; Voltage: NA; Project: GOLDEN-I LITE; PCB Footprint: RES0201_0-5; Footprint Path: Y:\MIS_DATABASE\Library\ALTIUM_TOOL\PCB_FOOTPRINTS\Altium_Footprint_Lib.PcbLib; Library Path: Y:\MIS_DATABASE\Library\ALTIUM_TOOL\SCHEMATICS_PARTS\MS_DISCRETE_Library.schlib; MECHANICAL 3D STEP FILE: RES0201_0-5; Chkd/date: MANIRAJA/050517; Crtd /date: MANIRAJA/050517; Datasheet: Y:\MIS_DATABASE\DATASHEETS\RESISTORS\RCXXXXL-SER_MAR18.PDF; Temperature: -55°C+125°C; Weight: 0.17mg; Height: 0.26MM; Library Ref: RESISTOR; Distributor_part_number: 311-10KNCT-ND; Distributor_name: DIGIKEY; Package: 0201; Wattage: 1/20W; Tolerance: 5%; Footprint Ref: RES0201_0-5
R18-R22 = RESISTOR_Dup6: RES 10K 1/20W 1% 0201; Mistral Part No: 110011040018-R; Mfr_name: YAGEO AMERICA; Mfr_part_number: RC0201FR-0710KL; Part_type: RESISTORS\FIXED; Project: GOLDEN-I LITE; Voltage: NA; Customs_HS_Code: 85332119; Custom_Duty: 15%; Footprint Path: Y:\MIS_DATABASE\Library\ALTIUM_TOOL\PCB_FOOTPRINTS\Altium_Footprint_Lib.PcbLib; Library Path: Y:\MIS_DATABASE\Library\ALTIUM_TOOL\SCHEMATICS_PARTS\MS_DISCRETE_Library.schlib; Footprint Ref: RES0201_0-5; Library Ref: RESISTOR; Tolerance: 1%; Wattage: 1/20W; Package: 0201; Distributor_name: DIGIKEY; Distributor_part_number: 311-10.0KMCT-ND; Height: 0.26MM; Weight: 0.17mg; Temperature: -55°C+125°C; Datasheet: Y:\MIS_DATABASE\DATASHEETS\RESISTORS\RCXXXXL-SER_MAR18.PDF; Crtd /date: MANIRAJA/270117; Chkd/date: VASANTHA/270117; MECHANICAL 3D STEP FILE: RES0201_0-5; PCB Footprint: RES0201_0-5
R24 = RESISTOR_Dup6: RES 33E 1/20W 5% 0201; Part_type: RESISTORS\FIXED; Mfr_part_number: ERJ-1GNJ330C; Mfr_name: PANASONIC-ECG; Mistral Part No: 110010070052-R; Custom_Duty: 15%; Customs_HS_Code: 85332119; Voltage: NA; Project: TI_AM62x_SKEVM_BRD; PCB Footprint: RES0201_0-5; Footprint Path: Y:\MIS_DATABASE\Library\ALTIUM_TOOL\PCB_FOOTPRINTS\Altium_Footprint_Lib.PcbLib; Library Path: Y:\MIS_DATABASE\Library\ALTIUM_TOOL\SCHEMATICS_PARTS\MS_DISCRETE_Library.schlib; MECHANICAL 3D STEP FILE: RES0201_0-5; Chkd/date: ALVY/070422; Crtd /date: TAMILARASU/070422; Datasheet: Y:\MIS_DATABASE\DATASHEETS\RESISTORS\PAN-ERJSER_NOV17.PDF; Temperature: -55°C+125°C; Weight: 0.15mg; Height: 0.26MM; Library Ref: RESISTOR; Distributor_part_number: P123303CT-ND; Distributor_name: DIGIKEY; Package: 0201; Wattage: 1/20W; Tolerance: 5%; Footprint Ref: RES0201_0-5
R671 = RESISTOR_Dup6: RES 100K 1/10W 1% 0402; Part_type: RESISTORS\FIXED; Mfr_part_number: ERJ-2RKF1003X; Mfr_name: PANASONIC-ECG; Mistral Part No: 110009030187-R; Custom_Duty: 15%; Customs_HS_Code: 85332119; Voltage: NA; Project: J32; PCB Footprint: RES0402_0-5; Footprint Path: Y:\MIS_DATABASE\Library\ALTIUM_TOOL\PCB_FOOTPRINTS\Altium_Footprint_Lib.PcbLib; Library Path: Y:\MIS_DATABASE\Library\ALTIUM_TOOL\SCHEMATICS_PARTS\MS_DISCRETE_Library.schlib; Footprint Ref: RES0402_0-5; Library Ref: RESISTOR; MECHANICAL 3D STEP FILE: RES0402_0-5; Chkd/date: VASANTHA/201216; Crtd /date: MAZHAR/130306; Datasheet: Y:\MIS_DATABASE\DATASHEETS\RESISTORS\PAN-ERJSER_NOV17.PDF; Temperature: -55°C+155°C; Weight: 0.8mg; Height: 0.40MM; Distributor_part_number: P100KLCT-ND; Distributor_name: DIGIKEY; Package: 0402; Wattage: 1/10W; Tolerance: 1%
TP1-TP9 = TESTPOINT: TESTPOINT CIR 20 SMD; Mfr_name: LOCAL; Custom_Duty: NA; Project: BT MODULE_CSRBC04; PCB Footprint: TP20_SMD; Customs_HS_Code: NA; Footprint Ref: TP20_SMD; Library Ref: TESTPOINT; Footprint Path: Y:\MIS_DATABASE\Library\ALTIUM_TOOL\PCB_FOOTPRINTS\Altium_Footprint_Lib.PcbLib; Library Path: Y:\MIS_DATABASE\Library\ALTIUM_TOOL\SCHEMATICS_PARTS\MS_DISCRETE_Library.schlib; MECHANICAL 3D STEP FILE: NA; Datasheet: NA; Temperature: NA; Weight: NA; Wattage: NA; Voltage: NA; Tolerance: NA; Chkd/date: SHREESHAIL/171006; Crtd /date: MAZHAR/171006; Height: NA; Distributor_part_number: NA; Distributor_name: NA; Package: SMD; Part_type: TESTPOINT; Mfr_part_number: TP20_SMD; Mistral Part No: NA; RoHS: NA
U1 = OSC4_ASFL3: OSC 32.768KHz 1.8V SMD; Mistral Part No: 130009031113-R; Mfr_name: ABRACON; Mfr_part_number: ASDK2-32.768KHZ-LRT; Part_type: OSCILLATORS; Project: AXON; Customs_HS_Code: 85437099; Custom_Duty: 24%; PCB Footprint: OSC4_ASDK_105X85_SMD; Voltage: 1.8V; Package: SMD; Distributor_name: DIGIKEY; Distributor_part_number: 535-10003-1-ND; Library Ref: OSC4_ASFL3; Height: 0.95MM; Weight: NA; Temperature: -40°C+85°C; Datasheet: Y:\MIS_DATABASE\DATASHEETS\MISC\CRY_OSC\ASDK.PDF; Crtd /date: USMAN/020409; Chkd/date: SUHAS/100710
U2 = SN74AVC2T244DQMR_X2SON8: IC 2-BIT UNDIRECTIONAL VOLTAGE-LEVEL TRANSLATOR X2SON8; Mistral Part No: 141016030002-R; Mfr_name: TEXAS INSTRUMENTS; Part_type: ICS\INTERFACE\LEVEL TRANSLATOR; Project: OCTASIC_3600; Tolerance: NA; Pb-Free: 85423100; Customs_HS_Code: 15%; PCB Footprint: X2SON8_15-74_70X50; Library Ref: SN74AVC2T244DQMR_X2SON8; Mfr_part_number: SN74AVC2T244DQMR; Voltage: NA; Wattage: NA; Package: X2SON8; Distributor_name: DIGIKEY; Distributor_part_number: 296-29674-1-ND; Height: 0.40MM; Weight: NA; Temperature: -40°C+85°C; Datasheet: Y:\MIS_DATABASE\DATASHEETS\ICS\INTERFACE\SN74AVC2T244.PDF; Crtd /date: VASANTHA/030316; Chkd/date: VASANTHA/060516